# EAGLE schematic main_board (EAGLE 9.6.2)
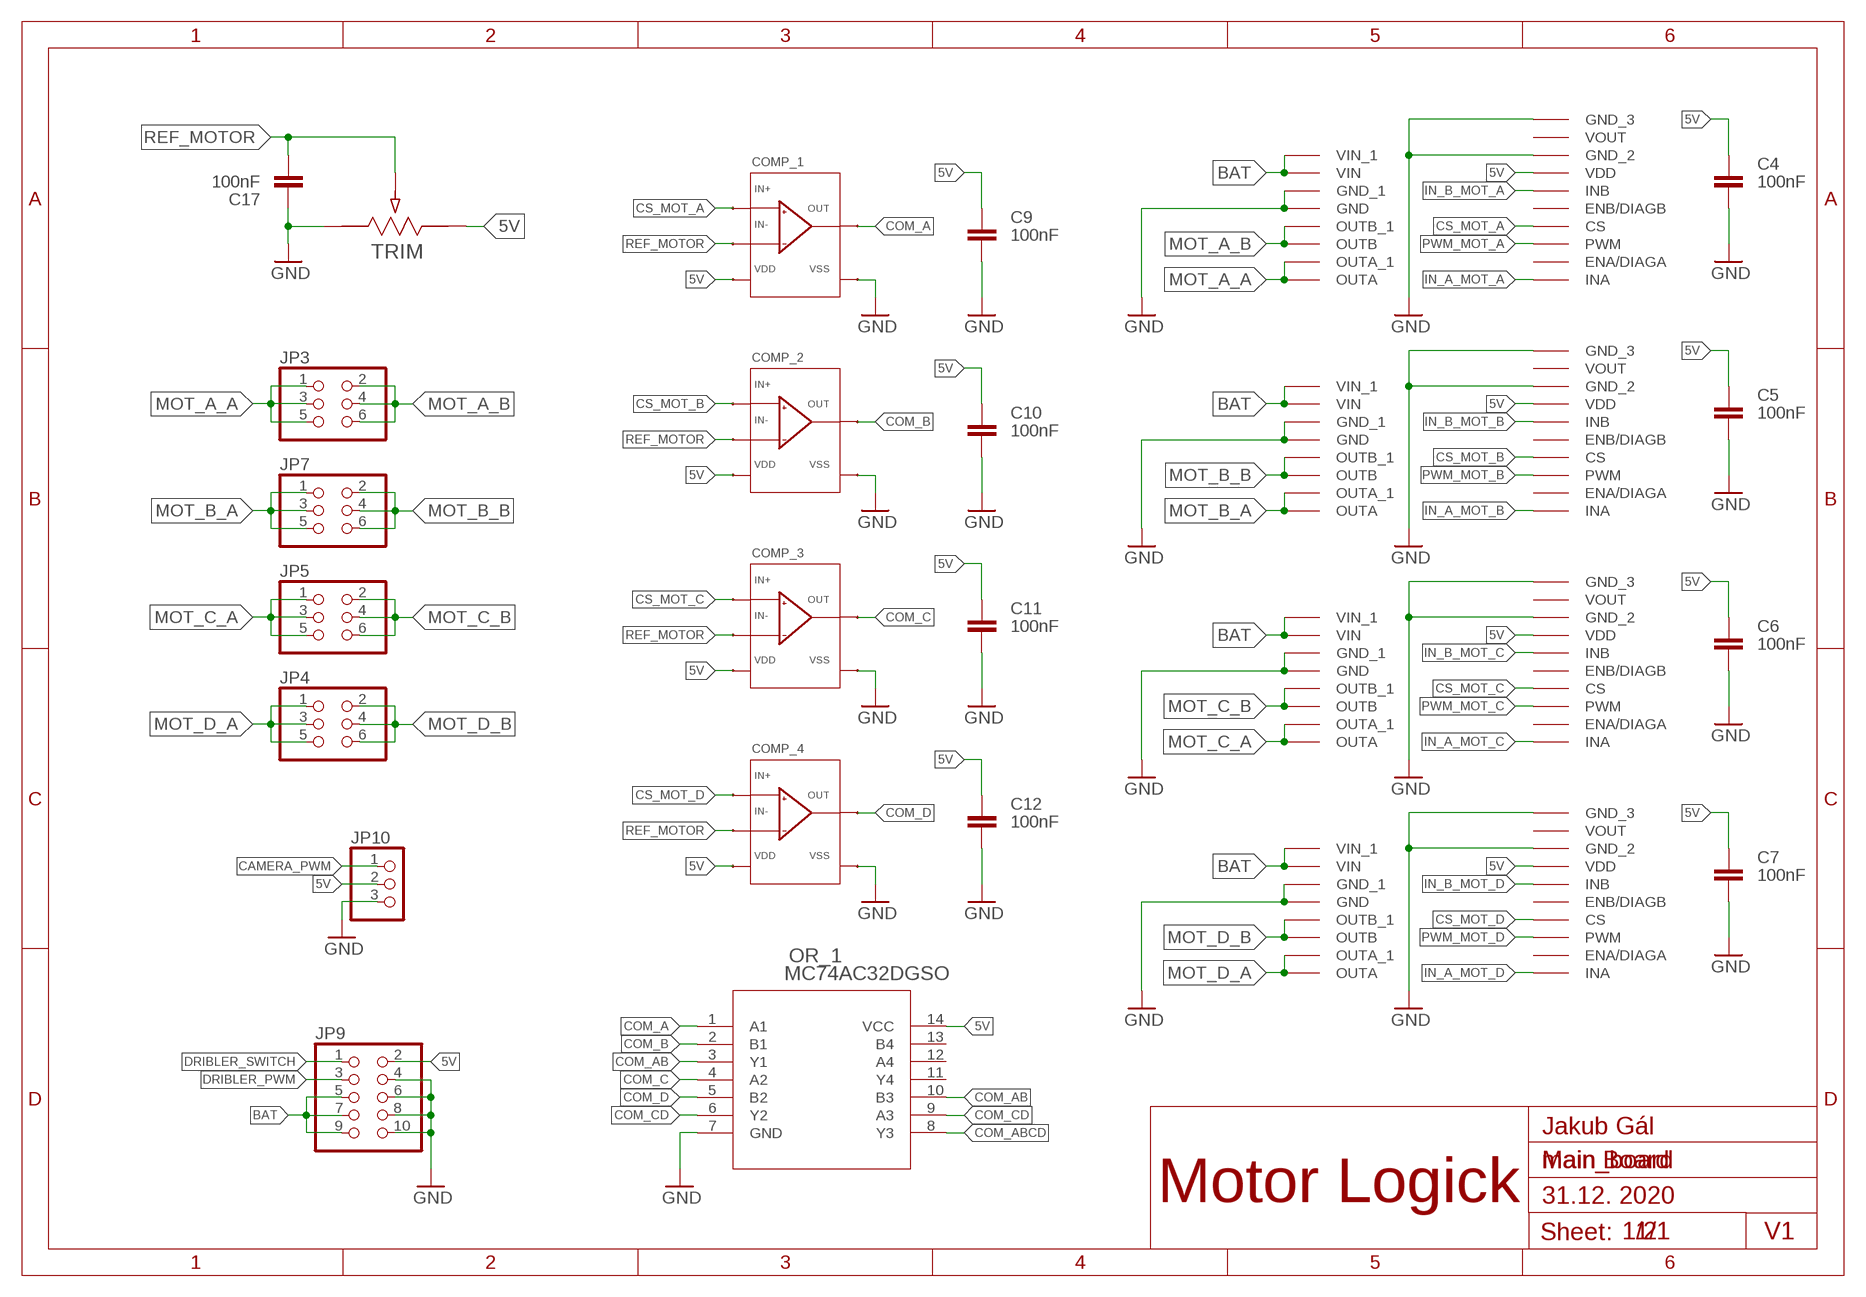
[diagram p0: schematic, sheet 1, part 1 of 2]
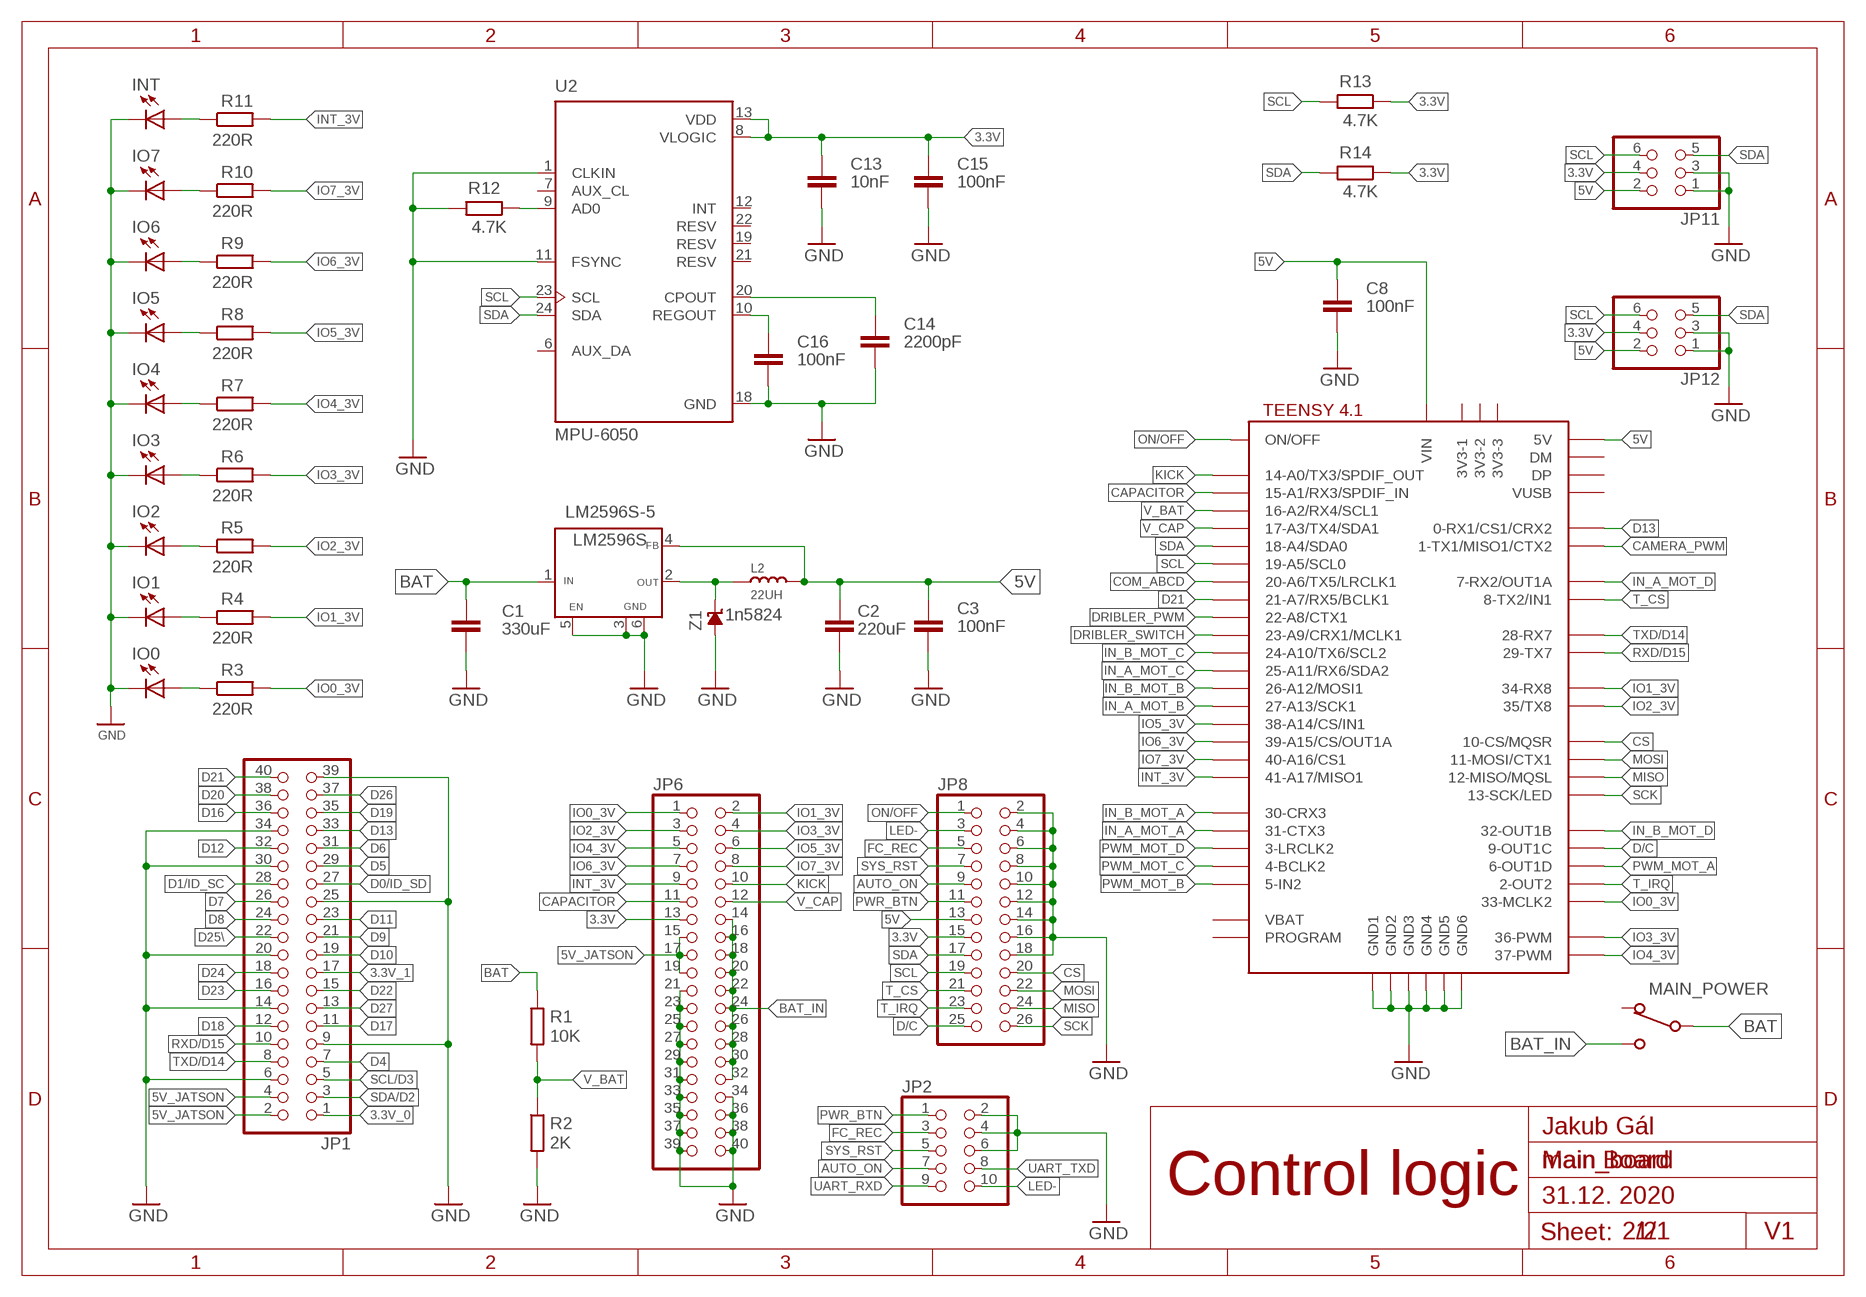
[diagram p1: schematic, sheet 1, part 2 of 2]

## Parts
C1  330uF  C_TANTALUM-2917(7343-METRIC)  [CAPM7343X310]
C2  220uF  C_TANTALUM-2917(7343-METRIC)  [CAPM7343X310]
C3  100nF  C-EUC0603  [C0603]
C4  100nF  C-EUC0603  [C0603]
C5  100nF  C-EUC0603  [C0603]
C6  100nF  C-EUC0603  [C0603]
C7  100nF  C-EUC0603  [C0603]
C8  100nF  C-EUC0603  [C0603]
C9  100nF  C-EUC0603  [C0603]
C10  100nF  C-EUC0603  [C0603]
C11  100nF  C-EUC0603  [C0603]
C12  100nF  C-EUC0603  [C0603]
C13  10nF  C-EUC0603  [C0603]
C14  2200pF  C-EUC0603  [C0603]
C15  100nF  C-EUC0603  [C0603]
C16  100nF  C-EUC0603  [C0603]
C17  100nF  C-EUC0603  [C0603]
COMP_1  TC75S56FUTE85LF  [SOT-353___(USV)_TOS]
COMP_2  TC75S56FUTE85LF  [SOT-353___(USV)_TOS]
COMP_3  TC75S56FUTE85LF  [SOT-353___(USV)_TOS]
COMP_4  TC75S56FUTE85LF  [SOT-353___(USV)_TOS]
DRIVER_A  MOTOR_DRIVER  [MOTOR_DRIVER]
DRIVER_B  MOTOR_DRIVER  [MOTOR_DRIVER]
DRIVER_C  MOTOR_DRIVER  [MOTOR_DRIVER]
DRIVER_D  MOTOR_DRIVER  [MOTOR_DRIVER]
INT  LEDCHIPLED_0603  [CHIPLED_0603]
IO0  LEDCHIPLED_0603  [CHIPLED_0603]
IO1  LEDCHIPLED_0603  [CHIPLED_0603]
IO2  LEDCHIPLED_0603  [CHIPLED_0603]
IO3  LEDCHIPLED_0603  [CHIPLED_0603]
IO4  LEDCHIPLED_0603  [CHIPLED_0603]
IO5  LEDCHIPLED_0603  [CHIPLED_0603]
IO6  LEDCHIPLED_0603  [CHIPLED_0603]
IO7  LEDCHIPLED_0603  [CHIPLED_0603]
JP1  PINHD-2X20_2.54-SMD  [2X20SMD]
JP2  PINHD-2X5_2.54  [2X05]
JP3  PINHD-2X3IDC  [2X03_IDC]
JP4  PINHD-2X3IDC  [2X03_IDC]
JP5  PINHD-2X3IDC  [2X03_IDC]
JP6  PINHD-2X20_2.54  [2X20]
JP7  PINHD-2X3IDC  [2X03_IDC]
JP8  PINHD-2X13_2.54  [2X13]
JP9  PINHD-2X5_2.54  [2X05]
JP10  PINHD-1X3  [1X03]
JP11  PINHD-2X3IDC  [2X03_IDC]
JP12  PINHD-2X3IDC  [2X03_IDC]
L2  22UH  INDUCTOR/FERRITE-BEAD0630  [INDUCTOR_L0630]
LM2596S  LM2596S-5  LM2596S  [TO263-5]
MAIN_POWER  PREP-1PB  [P-B069B]
OR_1  MC74AC32DGSO  MC74AC32DGSOIC-14_NB_ONS-M  [SOIC-14_NB_ONS-M]
R1  10K  R-EU_R0603  [R0603]
R2  2K  R-EU_R0603  [R0603]
R3  220R  R-EU_R0603  [R0603]
R4  220R  R-EU_R0603  [R0603]
R5  220R  R-EU_R0603  [R0603]
R6  220R  R-EU_R0603  [R0603]
R7  220R  R-EU_R0603  [R0603]
R8  220R  R-EU_R0603  [R0603]
R9  220R  R-EU_R0603  [R0603]
R10  220R  R-EU_R0603  [R0603]
R11  220R  R-EU_R0603  [R0603]
R12  4.7K  R-EU_R0603  [R0603]
R13  4.7K  R-EU_R0603  [R0603]
R14  4.7K  R-EU_R0603  [R0603]
TEENSY41  TEENSY41-E  [TENNSY41-E]
TRIM  3362W-1-103LF  [POT_3362W]
U2  MPU-6050  [QFN50P400X400X95-24N]
Z1  1n5824  SUPRESSOR_TVS-UD-SMAJ  [SUPRESSOR_SMAJ]

## Nets
3.3V: C13.1 C15.1 JP6.13 JP8.15 JP11.4 JP12.4 R13.1 R14.1 U2.8(VLOGIC) U2.13(VDD)
3.3V_0: JP1.1
3.3V_1: JP1.17
5V: C2.1 C3.1 C4.1 C5.1 C6.1 C7.1 C8.1 C9.1 C10.1 C11.1 C12.1 COMP_1.5 COMP_2.5 COMP_3.5 COMP_4.5 DRIVER_A.VDD DRIVER_B.VDD DRIVER_C.VDD DRIVER_D.VDD JP8.13 JP9.2 JP10.2 JP11.2 JP12.2 L2.2 LM2596S.4(FB) OR_1.14(VCC) TEENSY41.+5V(5V) TEENSY41.VIN TRIM.3
5V_JATSON: JP1.2 JP1.4 JP6.15 JP6.17 JP6.19
AUTO_ON: JP2.7 JP8.9
BAT: C1.1 DRIVER_A.VIN DRIVER_A.VIN_1 DRIVER_B.VIN DRIVER_B.VIN_1 DRIVER_C.VIN DRIVER_C.VIN_1 DRIVER_D.VIN DRIVER_D.VIN_1 JP9.5 JP9.7 JP9.9 LM2596S.1(IN) MAIN_POWER.2(2-COM) R1.1
BAT_IN: JP6.14 JP6.16 JP6.18 JP6.20 JP6.22 JP6.24 JP6.26 JP6.28 JP6.30 JP6.32 MAIN_POWER.1(1-OFF)
CAMERA_PWM: JP10.1 TEENSY41.1-TX1/MISO1/CTX2
CAPACITOR: JP6.11 TEENSY41.15-A1/RX3/SPDIF_IN
COM_A: COMP_1.4 OR_1.1(A1)
COM_AB: OR_1.3(Y1) OR_1.10(B3)
COM_ABCD: OR_1.8(Y3) TEENSY41.20-A6/TX5/LRCLK1
COM_B: COMP_2.4 OR_1.2(B1)
COM_C: COMP_3.4 OR_1.4(A2)
COM_CD: OR_1.6(Y2) OR_1.9(A3)
COM_D: COMP_4.4 OR_1.5(B2)
CS: JP8.20 TEENSY41.10-CS\MQSR(10-CS/MQSR)
CS_MOT_A: COMP_1.3 DRIVER_A.CS
CS_MOT_B: COMP_2.3 DRIVER_B.CS
CS_MOT_C: COMP_3.3 DRIVER_C.CS
CS_MOT_D: COMP_4.3 DRIVER_D.CS
D0/ID_SD: JP1.27
D1/ID_SC: JP1.28
D4: JP1.7
D5: JP1.29
D6: JP1.31
D7: JP1.26
D8: JP1.24
D9: JP1.21
D10: JP1.19
D11: JP1.23
D12: JP1.32
D13: JP1.33 TEENSY41.0-RX1/CS1/CRX2
D16: JP1.36
D17: JP1.11
D18: JP1.12
D19: JP1.35
D20: JP1.38
D21: JP1.40 TEENSY41.21-A7/RX5/BCLK1
D22: JP1.15
D23: JP1.16
D24: JP1.18
D25\: JP1.22
D26: JP1.37
D27: JP1.13
D/C: JP8.25 TEENSY41.9-OUT1C
DRIBLER_PWM: JP9.3 TEENSY41.22-A8/CTX1
DRIBLER_SWITCH: JP9.1 TEENSY41.23-A9/CRX1/MCLK1
FC_REC: JP2.3 JP8.5
GND: C1.2 C2.2 C3.2 C4.2 C5.2 C6.2 C7.2 C8.2 C9.2 C10.2 C11.2 C12.2 C13.2 C14.2 C15.2 C16.2 C17.1 COMP_1.2 COMP_2.2 COMP_3.2 COMP_4.2 DRIVER_A.GND DRIVER_A.GND_1 DRIVER_A.GND_2 DRIVER_A.GND_3 DRIVER_B.GND DRIVER_B.GND_1 DRIVER_B.GND_2 DRIVER_B.GND_3 DRIVER_C.GND DRIVER_C.GND_1 DRIVER_C.GND_2 DRIVER_C.GND_3 DRIVER_D.GND DRIVER_D.GND_1 DRIVER_D.GND_2 DRIVER_D.GND_3 INT.C IO0.C IO1.C IO2.C IO3.C IO4.C IO5.C IO6.C IO7.C JP1.6 JP1.9 JP1.14 JP1.20 JP1.25 JP1.30 JP1.34 JP1.39 JP2.2 JP2.4 JP2.6 JP6.21 JP6.23 JP6.25 JP6.27 JP6.29 JP6.31 JP6.33 JP6.34 JP6.35 JP6.36 JP6.37 JP6.38 JP6.39 JP6.40 JP8.2 JP8.4 JP8.6 JP8.8 JP8.10 JP8.12 JP8.14 JP8.16 JP8.18 JP9.4 JP9.6 JP9.8 JP9.10 JP10.3 JP11.1 JP11.3 JP12.1 JP12.3 LM2596S.3(GND) LM2596S.5(EN) LM2596S.6(GND) OR_1.7(GND) R2.2 R12.2 TEENSY41.GND1 TEENSY41.GND2 TEENSY41.GND3 TEENSY41.GND4 TEENSY41.GND5 TEENSY41.GND6 TRIM.1 U2.1(CLKIN) U2.11(FSYNC) U2.18(GND) Z1.A
IN_A_MOT_A: DRIVER_A.INA TEENSY41.31-CTX3
IN_A_MOT_B: DRIVER_B.INA TEENSY41.27-A13/SCK1
IN_A_MOT_C: DRIVER_C.INA TEENSY41.25-A11/RX6/SDA2
IN_A_MOT_D: DRIVER_D.INA TEENSY41.7-RX2/OUT1A
IN_B_MOT_A: DRIVER_A.INB TEENSY41.30-CRX3
IN_B_MOT_B: DRIVER_B.INB TEENSY41.26-A12/MOSI1
IN_B_MOT_C: DRIVER_C.INB TEENSY41.24-A10/TX6/SCL2
IN_B_MOT_D: DRIVER_D.INB TEENSY41.32-OUT1B
INT_3V: JP6.9 R11.2 TEENSY41.41-A17/MISO1
IO0_3V: JP6.1 R3.2 TEENSY41.33-MCLK2
IO1_3V: JP6.2 R4.2 TEENSY41.34-RX8
IO2_3V: JP6.3 R5.2 TEENSY41.35-TX8(35/TX8)
IO3_3V: JP6.4 R6.2 TEENSY41.36-PWM
IO4_3V: JP6.5 R7.2 TEENSY41.37-PWM
IO5_3V: JP6.6 R8.2 TEENSY41.38-A14/CS/IN1
IO6_3V: JP6.7 R9.2 TEENSY41.39-A15/CS/OUT1A
IO7_3V: JP6.8 R10.2 TEENSY41.40-A16/CS1
KICK: JP6.10 TEENSY41.14-A0/TX3/SPDIF_OUT
LED-: JP2.10 JP8.3
MISO: JP8.24 TEENSY41.12-MISO/MQSL
MOSI: JP8.22 TEENSY41.11-MOSI/CTX1
MOT_A_A: DRIVER_A.OUTA DRIVER_A.OUTA_1 JP3.1 JP3.3 JP3.5
MOT_A_B: DRIVER_A.OUTB DRIVER_A.OUTB_1 JP3.2 JP3.4 JP3.6
MOT_B_A: DRIVER_B.OUTA DRIVER_B.OUTA_1 JP7.1 JP7.3 JP7.5
MOT_B_B: DRIVER_B.OUTB DRIVER_B.OUTB_1 JP7.2 JP7.4 JP7.6
MOT_C_A: DRIVER_C.OUTA DRIVER_C.OUTA_1 JP5.1 JP5.3 JP5.5
MOT_C_B: DRIVER_C.OUTB DRIVER_C.OUTB_1 JP5.2 JP5.4 JP5.6
MOT_D_A: DRIVER_D.OUTA DRIVER_D.OUTA_1 JP4.1 JP4.3 JP4.5
MOT_D_B: DRIVER_D.OUTB DRIVER_D.OUTB_1 JP4.2 JP4.4 JP4.6
N$1: IO0.A R3.1
N$2: IO1.A R4.1
N$3: C14.1 U2.20(CPOUT)
N$4: IO2.A R5.1
N$5: R12.1 U2.9(AD0)
N$6: IO3.A R6.1
N$7: C16.1 U2.10(REGOUT)
N$8: IO4.A R7.1
N$10: IO5.A R8.1
N$12: IO6.A R9.1
N$14: IO7.A R10.1
N$16: INT.A R11.1
N$61: L2.1 LM2596S.2(OUT) Z1.C
ON/OFF: JP8.1 TEENSY41.ON/OFF
PWM_MOT_A: DRIVER_A.PWM TEENSY41.6-OUT1D
PWM_MOT_B: DRIVER_B.PWM TEENSY41.5-IN2
PWM_MOT_C: DRIVER_C.PWM TEENSY41.4-BCLK2
PWM_MOT_D: DRIVER_D.PWM TEENSY41.3-LRCLK2
PWR_BTN: JP2.1 JP8.11
REF_MOTOR: C17.2 COMP_1.1 COMP_2.1 COMP_3.1 COMP_4.1 TRIM.2
RXD/D15: JP1.10 TEENSY41.29-TX7
SCK: JP8.26 TEENSY41.13-SCK/LED
SCL: JP8.19 JP11.6 JP12.6 R13.2 TEENSY41.19-A5/SCL0 U2.23(SCL)
SCL/D3: JP1.5
SDA: JP8.17 JP11.5 JP12.5 R14.2 TEENSY41.18-A4/SDA0 U2.24(SDA)
SDA/D2: JP1.3
SYS_RST: JP2.5 JP8.7
T_CS: JP8.21 TEENSY41.8-TX2/IN1
T_IRQ: JP8.23 TEENSY41.2-OUT2
TXD/D14: JP1.8 TEENSY41.28-RX7
UART_RXD: JP2.9
UART_TXD: JP2.8
V_BAT: R1.2 R2.1 TEENSY41.16-A2/RX4/SCL1
V_CAP: JP6.12 TEENSY41.17-A3/TX4/SDA1
Unconnected: DRIVER_A.ENA/DIAGA DRIVER_A.ENB/DIAGB DRIVER_A.VOUT DRIVER_B.ENA/DIAGA DRIVER_B.ENB/DIAGB DRIVER_B.VOUT DRIVER_C.ENA/DIAGA DRIVER_C.ENB/DIAGB DRIVER_C.VOUT DRIVER_D.ENA/DIAGA DRIVER_D.ENB/DIAGB DRIVER_D.VOUT MAIN_POWER.3(3-ON) OR_1.11(Y4) OR_1.12(A4) OR_1.13(B4) TEENSY41.3V3-1 TEENSY41.3V3-2 TEENSY41.3V3-3 TEENSY41.DM TEENSY41.DP TEENSY41.PROGRAM TEENSY41.VBAT TEENSY41.VUSB U2.6(AUX_DA) U2.7(AUX_CL) U2.12(INT) U2.19(RESV) U2.21(RESV) U2.22(RESV)

## Notes on the sheet
- Jakub Gál | Jakub Gál
- Main Board | Main Board
- Motor Logick | Control logic
- 31.12. 2020 | 31.12. 2020
- 1/2 | V1 | 2/2 | V1

## Library data of the parts
C1 C2 = Capacitor:C: Capacitor - Generic; CATEGORY: Capacitor
C3-C17 = rcl:C-EU: CAPACITOR, European symbol; SPICEPREFIX: C
COMP_1-COMP_4 = comparator:TC75S56FUTE85LF
DRIVER_A DRIVER_B DRIVER_C DRIVER_D = Moja:MOTOR_DRIVER
INT IO0 IO1-IO7 = audio amplifier example:LED
JP1 JP6 = pinhead-1:PINHD-2X20: PIN HEADER
JP2 JP9 = pinhead-1:PINHD-2X5: PIN HEADER
JP3-JP5 JP7 JP11 JP12 = pinhead-1:PINHD-2X3: PIN HEADER
JP8 = pinhead-1:PINHD-2X13: PIN HEADER
JP10 = Connector:PINHD-1X3: PIN HEADER; CATEGORY: CONNECTOR; SUB-CATEGORY: PIN-HEADER
L2 = BeagleBone_Blue_R3:INDUCTOR/FERRITE-BEAD
LM2596S = TABOR K1:LM2596: DC/DC pulzny regulator STEP-DOWN / 3A upraveny podla katalogu
MAIN_POWER = TABOR K1:PREP-1P: 1-polovy prepinac
OR_1 = 74VHC32D:MC74AC32DG; COPYRIGHT: Copyright (C) 2016 Accelerated Designs. All rights reserved; MANUFACTURER_PART_NUMBER: MC74VHC32DR2G; SOURCELIBRARY: ONSemi_2017-12-12_1; VENDOR: ON Semiconductor
R1-R14 = rcl:R-EU_: RESISTOR, European symbol; SPICEPREFIX: R
TEENSY41 = teensy:TEENSY41-E
TRIM = 3362:3362W-1-103LF; BUILT_BY: EMA_UL_Team; MANUFACTURER_PART_NUMBER: 3362W-1-103LF; SOURCELIBRARY: Bourns_2012-08-08; VENDOR: Bourns Electronics
U2 = MPU-6050:MPU-6050: MPU-6050 Six-Axis (Gyro + Accelerometer) MEMS MotionTracking™ Devices Check prices <https://snapeda.com/parts/MPU-6050/TDK%20InvenSense/view-part/?ref=eda>; AVAILABILITY: Warning; DESCRIPTION: Accelerometer, Gyroscope, 6 Axis Sensor I²C Output; DIGIKEY-PURCHASE-URL: https://snapeda.com/shop?store=DigiKey&id=4705740; MF: TDK InvenSense; MOUSER-PURCHASE-URL: https://snapeda.com/shop?store=Mouser&id=4705740; MP: MPU-6050; PACKAGE: VFQFN-24 TDK InvenSense; PRICE: None
Z1 = 52101-101-REV-A:SUPRESSOR_TVS-UD-: TVS UNI-DIRECTIONAL